# EAGLE design SparkFun LoRaSerial - 1W (EAGLE 9.6.2)
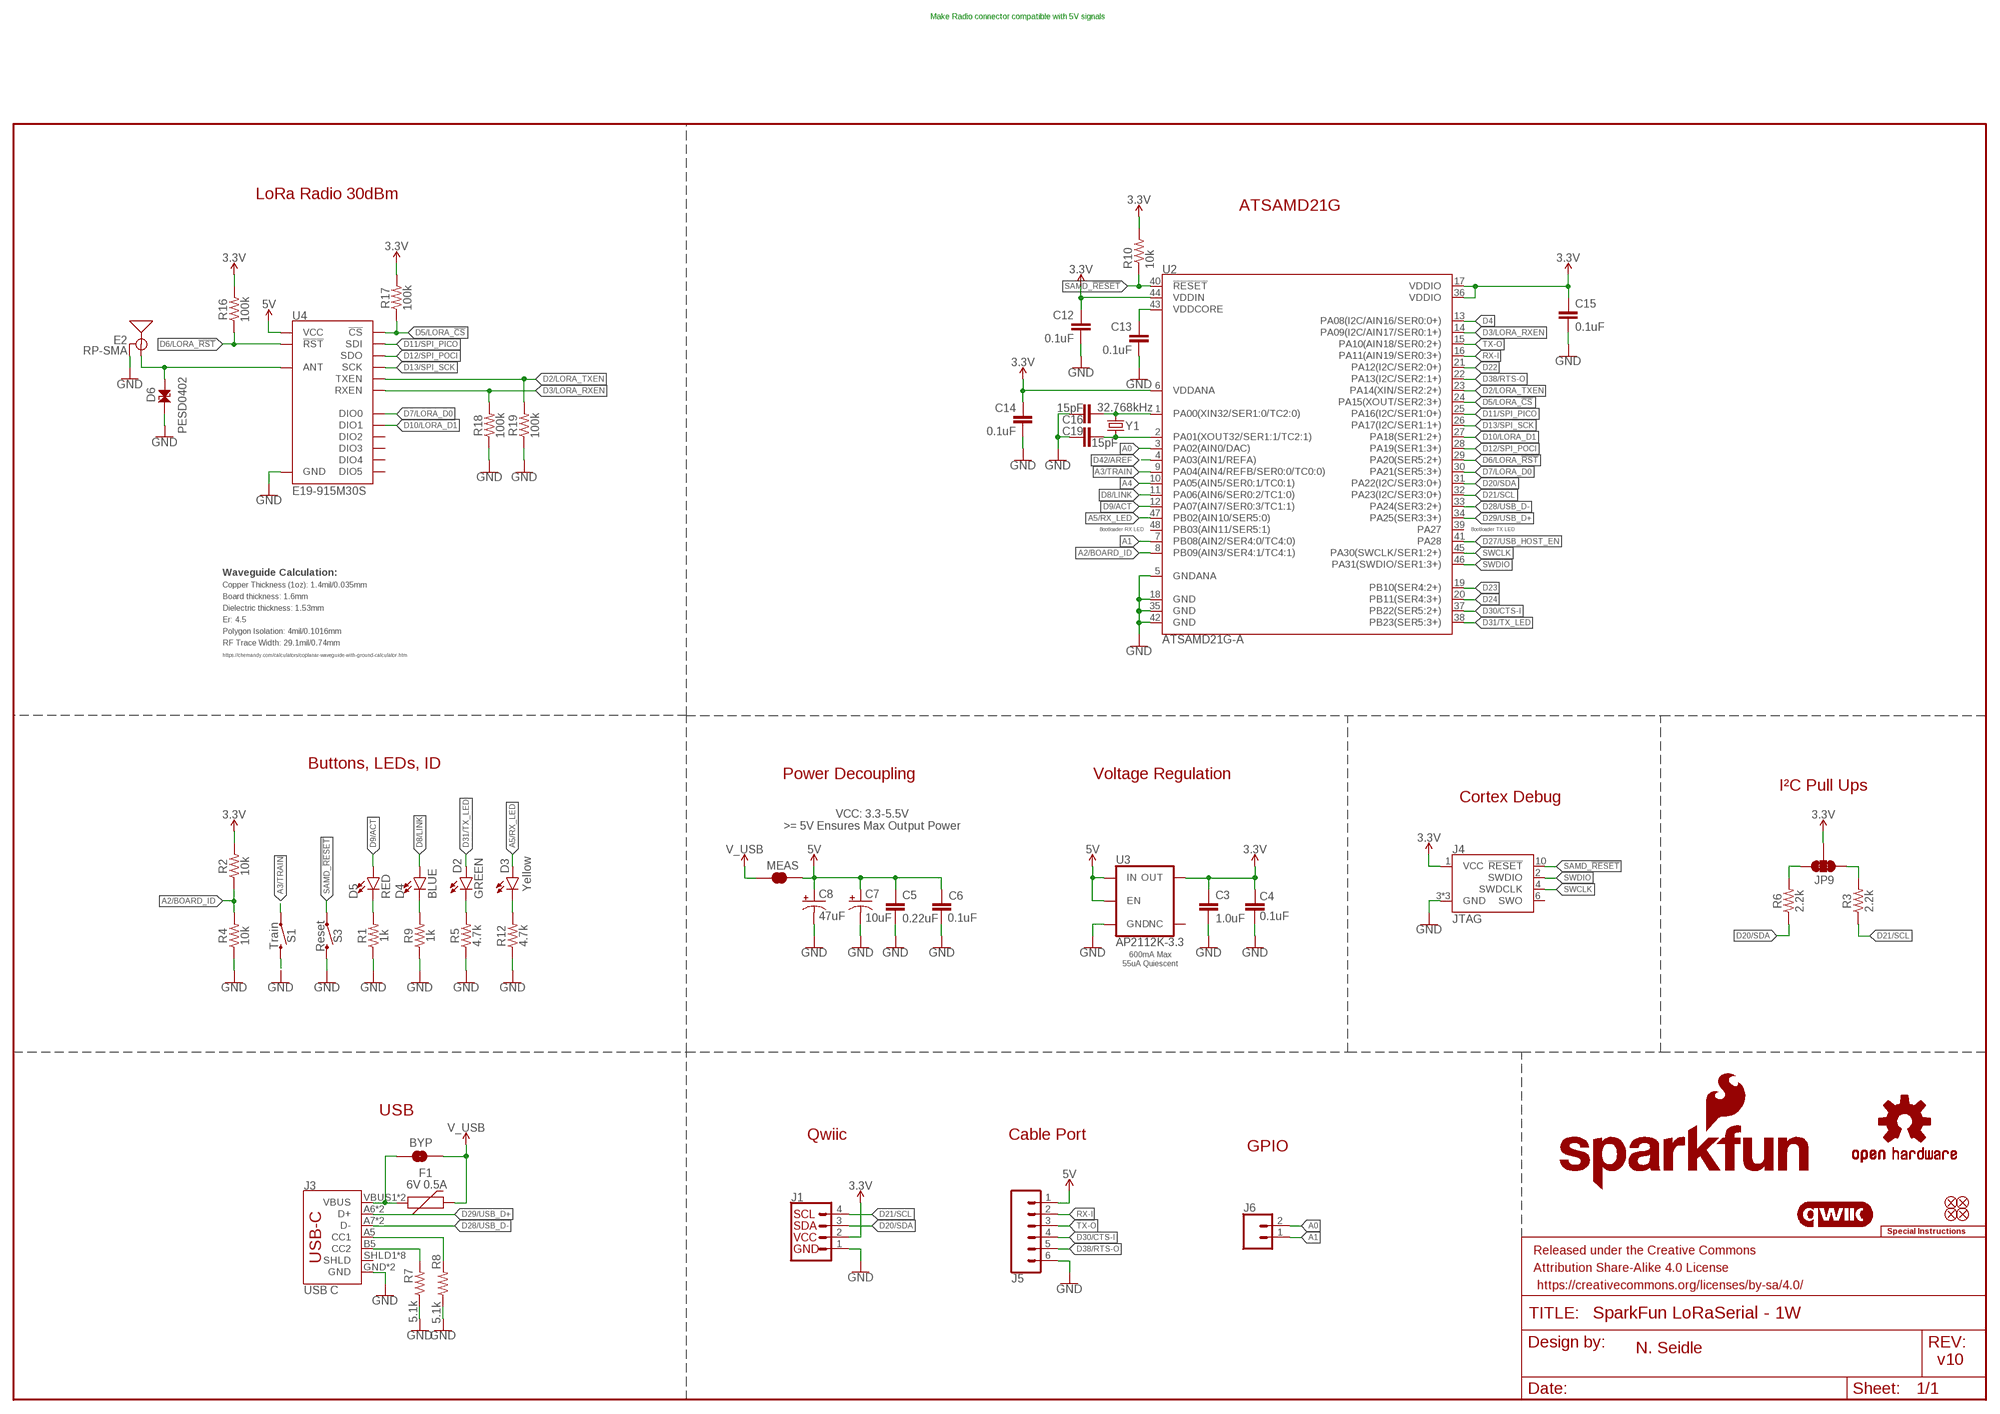
[diagram p0: schematic, sheet 1]

## Parts
BYP  JUMPER-SMT_2_NO_SILK  [SMT-JUMPER_2_NO_SILK]
C3  1.0uF  1.0UF-0603-16V-10%-X7R  [0603]
C4  0.1uF  0.1UF-0603-25V-5%  [0603]
C5  0.22uF  0.22UF-0603-25V-10%  [0603]
C6  0.1uF  0.1UF-0603-25V-(+80/-20%)  [0603]
C7  10uF  10UF-POLAR-EIA3216-16V-10%(TANT)  [EIA3216]
C8  47uF  47UF-POLAR-EIA3528-10V-10%  [EIA3528]
C12  0.1uF  0.1UF-0603-25V-(+80/-20%)  [0603]
C13  0.1uF  0.1UF-0603-25V-(+80/-20%)  [0603]
C14  0.1uF  0.1UF-0603-25V-(+80/-20%)  [0603]
C15  0.1uF  0.1UF-0603-25V-(+80/-20%)  [0603]
C16  15pF  15PF-0603-50V-5%  [0603]
C19  15pF  15PF-0603-50V-5%  [0603]
D2  GREEN  LED-GREEN0603  [LED-0603]
D3  Yellow  LED-YELLOW0603  [LED-0603]
D4  BLUE  LED-BLUE0603  [LED-0603]
D5  RED  LED-RED0603  [LED-0603]
D6  PESD0402  PESD0402-0402T  [0402-TIGHT]
E2  RP-SMA  ANTENNA-SMA-GROUNDEDEDGE_RPSMA  [RP-SMA-EDGE]
F1  6V 0.5A  PPTC_6V500MA  [0805]
FID1  FIDUCIAL1X2  [FIDUCIAL-1X2]
FID2  FIDUCIAL1X2  [FIDUCIAL-1X2]
FID3  FIDUCIAL1X2  [FIDUCIAL-1X2]
FID4  FIDUCIAL1X2  [FIDUCIAL-1X2]
FRAME3  FRAME-LEDGER  [CREATIVE_COMMONS]
J1  QWIIC_RIGHT_ANGLE  QWIIC_CONNECTORJS-1MM  [JST04_1MM_RA]
J3  USB C  USB_C16PIN  [USB-C-16P]
J4  JTAG  CORTEX_JTAG_DEBUG_MINIMUM_PTH_NS  [2X5-PTH-1.27MM-NO_SILK]
J5  CONN_06JST-SMD-LOCKING  [JST-6-SMD-1.25MM-LOCKING]
J6  CONN_021X02_NO_SILK  [1X02_NO_SILK]
JP9  JUMPER-SMT_3_2-NC_TRACE_SILK  [SMT-JUMPER_3_2-NC_TRACE_SILK]
LOGO1  SPECIAL_INSTRUCTIONS-ORDERING  [ORDERING_INSTRUCTIONS]
LOGO2  SFE_LOGO_NAME_FLAME.1_INCH  [SFE_LOGO_NAME_FLAME_.1]
LOGO3  QWIIC_LOGO_CONNECTOR  [QWIIC_5.5MM]
LOGO4  OSHW-LOGOMINI  [OSHW-LOGO-MINI]
LOGO5  SFE_LOGO_NAME_FLAME10_MM  [SFE_LOGO_NAME_FLAME_10MM]
MEAS  JUMPER-COMBO_2_NC_TRACE  [COMBO-JUMPER_2_NC_TRACE]
R1  1k  1KOHM-0603-1/10W-1%  [0603]
R2  10k  10KOHM-0603-1/10W-1%  [0603]
R3  2.2k  2.2KOHM-0603-1/10W-1%  [0603]
R4  10k  10KOHM-0603-1/10W-1%  [0603]
R5  4.7k  4.7KOHM-0603-1/10W-1%  [0603]
R6  2.2k  2.2KOHM-0603-1/10W-1%  [0603]
R7  5.1k  5.1KOHM5.1KOHM-0603-1/10W-1%  [0603]
R8  5.1k  5.1KOHM5.1KOHM-0603-1/10W-1%  [0603]
R9  1k  1KOHM-0603-1/10W-1%  [0603]
R10  10k  10KOHM-0603-1/10W-1%  [0603]
R12  4.7k  4.7KOHM-0603-1/10W-1%  [0603]
R16  100k  100KOHM-0603-1/10W-1%  [0603]
R17  100k  100KOHM-0603-1/10W-1%  [0603]
R18  100k  100KOHM-0603-1/10W-1%  [0603]
R19  100k  100KOHM-0603-1/10W-1%  [0603]
S1  Train  MOMENTARY-SWITCH-SPST-SMD-RIGHT-ANGLE  [TACTILE_SWITCH_SMD_RIGHT_ANGLE]
S3  Reset  MOMENTARY-SWITCH-SPST-SMD-5.2-TALL-REDUNDANT  [TACTILE_SWITCH_SMD_5.2MM]
U2  ATSAMD21G-A  [TQFP-48]
U3  AP2112K-3.3  V_REG_AP2112K-3.3V  [SOT23-5]
U4  E19-915M30S  E19-915MS1W  [E19-915MS1W]
Y1  32.768kHz  CRYSTAL3.2X1.5MM  [CRYSTAL-SMD-3.2X1.5MM]

## Nets
3.3V [3.3V]: C3.1 C4.2 C12.1 C14.1 C15.1 J1.2 J4.1(VCC) JP9.2 R2.2 R10.2 R16.2 R17.2 U2.6(VDDANA) U2.17(VDDIO) U2.36(VDDIO) U2.44(VDDIN) U3.5(OUT)
5V: C5.1 C6.1 C7.+ C8.A(+) J5.1 MEAS.2 MEAS.4 U3.1(IN) U3.3(EN) U4.11(VCC)
A0: J6.2 U2.3(PA02(AIN0/DAC))
A1: J6.1 U2.7(PB08(AIN2/SER4:0/TC4:0))
A2/BOARD_ID: R2.1 R4.2 U2.8(PB09(AIN3/SER4:1/TC4:1))
A3/TRAIN: S1.1 U2.9(PA04(AIN4/REFB/SER0:0/TC0:0))
A4: U2.10(PA05(AIN5/SER0:1/TC0:1))
A5/RX_LED: D3.A U2.47(PB02(AIN10/SER5:0))
CC1: J3.A5(CC1) R8.2
CC2: J3.B5(CC2) R7.2
D2/LORA_TXEN: R19.2 U2.23(PA14(XIN/SER2:2+)) U4.16(TXEN)
D3/LORA_RXEN: R18.2 U2.14(PA09(I2C/AIN17/SER0:1+)) U4.17(RXEN)
D4: U2.13(PA08(I2C/AIN16/SER0:0+))
D5/LORA_!CS!: R17.1 U2.24(PA15(XOUT/SER2:3+)) U4.15(!CS)
D6/LORA_!RST!: R16.1 U2.29(PA20(SER5:2+)) U4.8(!RST)
D7/LORA_D0: U2.30(PA21(SER5:3+)) U4.7(DIO0)
D8/LINK: D4.A U2.11(PA06(AIN6/SER0:2/TC1:0))
D9/ACT: D5.A U2.12(PA07(AIN7/SER0:3/TC1:1))
D10/LORA_D1: U2.27(PA18(SER1:2+)) U4.6(DIO1)
D11/SPI_PICO: U2.25(PA16(I2C/SER1:0+)) U4.14(SDI)
D12/SPI_POCI: U2.28(PA19(SER1:3+)) U4.13(SDO)
D13/SPI_SCK: U2.26(PA17(I2C/SER1:1+)) U4.12(SCK)
D20/SDA: J1.3 R6.1 U2.31(PA22(I2C/SER3:0+))
D21/SCL: J1.4 R3.1 U2.32(PA23(I2C/SER3:0+))
D22: U2.21(PA12(I2C/SER2:0+))
D23: U2.19(PB10(SER4:2+))
D24: U2.20(PB11(SER4:3+))
D27/USB_HOST_EN: U2.41(PA28)
D28/USB_D-: J3.A7(D-) J3.B7(D-) U2.33(PA24(SER3:2+))
D29/USB_D+: J3.A6(D+) J3.B6(D+) U2.34(PA25(SER3:3+))
D30/CTS-I: J5.4 U2.37(PB22(SER5:2+))
D31/TX_LED: D2.A U2.38(PB23(SER5:3+))
D38/RTS-O: J5.5 U2.22(PA13(I2C/SER2:1+))
D42/AREF: U2.4(PA03(AIN1/REFA))
GND: C3.2 C4.1 C5.2 C6.2 C7.- C8.C(-) C12.2 C13.2 C14.2 C15.2 C16.1 C19.2 D6.1 E2.GND@0(GND) E2.GND@1(GND) E2.GND@2(GND) E2.GND@3(GND) J1.1 J3.GND J3.GND2(GND) J4.3(GND) J4.5(GND) J4.9(GND) J5.6 R1.1 R4.1 R5.1 R7.1 R8.1 R9.1 R12.1 R18.1 R19.1 S1.2 S3.3 S3.4 U2.5(GNDANA) U2.18(GND) U2.35(GND) U2.42(GND) U3.2(GND) U4.1(GND) U4.9(GND) U4.10(GND) U4.18(GND) U4.20(GND) U4.21(GND) U4.22(GND)
LORA_ANT: D6.2 E2.SIG(SIGNAL) U4.19(ANT)
N$1: C19.1 U2.2(PA01(XOUT32/SER1:1/TC2:1)) Y1.P$1
N$2: C16.2 U2.1(PA00(XIN32/SER1:0/TC2:0)) Y1.P$2
N$3: D3.C R12.2
N$4: D2.C R5.2
N$7: D5.C R1.2
N$8: D4.C R9.2
RX-I: J5.2 U2.16(PA11(AIN19/SER0:3+))
SAMD_!RESET!: J4.10(!RESET) R10.1 S3.1 S3.2 U2.40(!RESET!)
SCL_PU1: JP9.1 R3.2
SDA_PU1: JP9.3 R6.2
SWCLK: J4.4(SWDCLK) U2.45(PA30(SWCLK/SER1:2+))
SWDIO: J4.2(SWDIO) U2.46(PA31(SWDIO/SER1:3+))
TX-O: J5.3 U2.15(PA10(AIN18/SER0:2+))
V_USB: BYP.2 F1.2 MEAS.1 MEAS.3
VDDCORE: C13.1 U2.43(VDDCORE)
VUSB [3.3V]: BYP.1 F1.1 J3.VBUS1(VBUS) J3.VBUS2(VBUS)
Unconnected: J3.SHLD1(SHLD) J3.SHLD2(SHLD) J3.SHLD3(SHLD) J3.SHLD4(SHLD) J3.SHLD5(SHLD) J3.SHLD6(SHLD) J3.SHLD7(SHLD) J3.SHLD8(SHLD) J4.6(SWO) U2.39(PA27) U2.48(PB03(AIN11/SER5:1)) U3.4(NC) U4.2(DIO5) U4.3(DIO4) U4.4(DIO3) U4.5(DIO2)

## Notes on the sheet
- Make Radio connector compatible with 5V signals
- LoRa Radio 30dBm
- ATSAMD21G
- Bootloader RX LED | Bootloader TX LED
- Waveguide Calculation:
- Copper Thickness (1oz): 1.4mil/0.035mm
- Board thickness: 1.6mm
- Dielectric thickness: 1.53mm
- Er: 4.5
- Polygon Isolation: 4mil/0.1016mm
- RF Trace Width: 29.1mil/0.74mm
- https://chemandy.com/calculators/coplanar-waveguide-with-ground-calculator.htm
- Buttons, LEDs, ID
- Power Decoupling | Voltage Regulation
- I²C Pull Ups
- Cortex Debug
- VCC: 3.3-5.5V
  >= 5V Ensures Max Output Power
- 600mA Max
  55uA Quiescent
- USB
- Qwiic | Cable Port
- GPIO
- N. Seidle
- v10

## Library data of the parts
BYP = SparkFun-Jumpers:JUMPER-SMT_2_NO: Normally open jumper This jumper has two pads in close proximity to each other. Apply solder to close the connection. Round pads are easier to solder for beginners, but are a lot larger. SparkFun Product that uses the round pads: SparkFun EL Sequencer <https://www.sparkfun.com/products/12781>
C3 = SparkFun-Capacitors:1.0UF: 1µF ceramic capacitors A capacitor is a passive two-terminal electrical component used to store electrical energy temporarily in an electric field.; PROD_ID: CAP-13930
C4 = SparkFun-Capacitors:0.1UF: 0.1µF ceramic capacitors A capacitor is a passive two-terminal electrical component used to store electrical energy temporarily in an electric field.; PROD_ID: CAP-08604
C5 = SparkFun-Capacitors:0.22UF: 0.22µF ceramic capacitors A capacitor is a passive two-terminal electrical component used to store electrical energy temporarily in an electric field.; PROD_ID: CAP-07822
C6 C12-C15 = SparkFun-Capacitors:0.1UF: 0.1µF ceramic capacitors A capacitor is a passive two-terminal electrical component used to store electrical energy temporarily in an electric field.; PROD_ID: CAP-00810
C7 = SparkFun-Capacitors:10UF-POLAR: 10.0µF polarized capacitors A capacitor is a passive two-terminal electrical component used to store electrical energy temporarily in an electric field.; PROD_ID: CAP-00811
C8 = SparkFun-Capacitors:47UF-POLAR: 47µF polarized capacitors A capacitor is a passive two-terminal electrical component used to store electrical energy temporarily in an electric field.; PROD_ID: CAP-08310
C16 C19 = SparkFun-Capacitors:15PF: 15pF ceramic capacitors A capacitor is a passive two-terminal electrical component used to store electrical energy temporarily in an electric field.; PROD_ID: CAP-07881
D2 = SparkFun-LED:LED-GREEN: Green SMD LED Used in manufacturing of various products at SparkFun Packages: 0603 - SMD 0603 package [Product Link] <http://www.futureelectronics.com/en/technologies/semiconductors/optoelectronics/leds/Pages/9894312-LTST-C190GKT.aspx?CrossPart=HSMG-C190&IM=0> LilyPad 1206 - SMD1206 LilyPad package [Product Link] <http://www.futureelectronics.com/en/Technologies/Product.aspx?ProductID=IN150NGHARVATEKCORPORATION2049943&IM=0> 1206 - SMD1206 package [Product Link] <http://www.futureelectronics.com/en/technologies/semiconductors/optoelectronics/leds/Pages/8315665-LTST-C150KGKT.aspx?IM=0> 1206 Bottom Mount -SMD 1206 Bottom Mount [Product Link] <http://www.digikey.com/product-detail/en/lite-on-inc/LTST-C230KGKT/160-1456-1-ND/386854> SparkFun Products: Pro Mini 328 -5V <https://www.sparkfun.com/products/821> RedBoard <https://www.sparkfun.com/products/12757> MP3 Trigger <https://www.sparkfun.com/products/13720> Makey Makey <https://www.sparkfun.com/products/11076>; PROD_ID: DIO-00821
D3 = SparkFun-LED:LED-YELLOW: Yellow SMD LED Used in manufacturing several products at SparkFun. Packages: 0603 - SMD 0603 package[Product Link] <http://www.kingbrightusa.com/product.asp?catalog_name=LED&product_id=APT1608SYCK> 0603 -SMART - SMART SMD 0603 package (more efficient/more expensive) [Product Link] <http://www.osram-os.com/osram_os/en/products/product-catalog/led-light-emitting-diodes/smartled-0603/ly-l29k/index.jsp> LilyPad - SMD1206 package[Product Datasheet] <https://www.sparkfun.com/datasheets/DevTools/LilyPad/Q150YUS4.pdf> SparkFun Products: Blynk Board <https://www.sparkfun.com/products/13794> IOIO-OTG <https://www.sparkfun.com/products/13613> XBee Explorer Serial <https://www.sparkfun.com/products/13225>; PROD_ID: DIO-09003
D4 = SparkFun-LED:LED-BLUE: Blue SMD LED Used in manufacturing of various products at SparkFun Packages: 0603 - SMD 0603 package [Product Link] <http://www.digikey.com/product-detail/en/SMLE12BC7TT86/511-1589-2-ND/1641808> 1206 - SMD1206 package [Product Link] <http://www.digikey.com/product-detail/en/lite-on-inc/LTST-C150TBKT/160-1643-1-ND/573584> SparkFun Products: ESP8266 Thing-Dev Board <https://www.sparkfun.com/products/13711> RedBoard <https://www.sparkfun.com/products/12757>; PROD_ID: DIO-08575
D5 = SparkFun-LED:LED-RED: Red SMD LED Used in manufacturing of most products at SparkFun Packages: 0603 - SMD 0603 package [Product Link] <http://docs.avagotech.com/docs/AV02-0551EN> 0603 SMART - SMD 0603 SMART package ( more efficient and expensive)[Product Link] <http://www.osram-os.com/Graphics/XPic2/00077099_0.pdf> 1206 - SMD1206 package [Product Link] <https://www.sparkfun.com/datasheets/DevTools/LilyPad/Q150OVS4.pdff> SparkFun Products: Pro Mini 328 -5V <https://www.sparkfun.com/products/821> RedBoard <https://www.sparkfun.com/products/12757> IOIO-OTG <https://www.sparkfun.com/products/13613>; PROD_ID: DIO-00819
D6 = SparkFun-DiscreteSemi:PESD0402: ESD protection diode PESD is used to protect a signal line from ESD.; PROD_ID: DIO-15359
E2 = SparkFun-RF:ANTENNA-SMA-GROUNDED: SMA Antenna Connector w/ Ground Edge-mount and SMD SMA connectors for RF Antennas. **4-LAYER BOARD WARNING!!** When designing a 4-layer board using any of the SMD variants, you will need to manually add a cutout polygon on any internal power layers to make sure that you don't end up with exposed copper around the edge of the routed hole for these connectors. Exposed power copper could then short to the connector body - and that would be bad. Why hasn't anyone added the cutout polygons directly to the connector footprint? Well, your internal layers (usually 2 and 15) may be covered with GND polygons and you might well want the copper to go all the way to the edge, especially under the connector SIGNAL pin. So adding cutouts to the footprint might make matters worse, not better...; PROD_ID: CONN-00827
F1 = SparkFun-Fuses:PPTC: Resettable Fuse PPTC Resettable Fuse. Really a sort of resistor with a polymeric positive temperature coefficient whose resistance increases dramatically with an increase in temperature. When heated by the power passing through the resistance rises causing the current to be limited, protecting the circuit. This is achieved by the transition of the polymer from a crystalline to an amorphous state where the conductive carbon separates breaking the conductive pathways found in the cool crystalline structure. When a PPTC cools back down it resumes conducting letting the circuit turn back on. SparkFun Products: SparkFun RedBoard - Programmed with Arduino <https://www.sparkfun.com/products/12757> Pro Micro - 5V/16MHz <https://www.sparkfun.com/products/12640> Arduino Pro 328 - 5V/16MHz <https://www.sparkfun.com/products/10915> MP3 Trigger <https://www.sparkfun.com/products/13720>; PROD_ID: RES-13945
FID1-FID4 = SparkFun-Aesthetics:FIDUCIAL: Fiducial Alignment Points Point-of-reference for pick-and-place machines and other optical instruments.
FRAME3 = SparkFun-Aesthetics:FRAME-LEDGER: Schematic Frame - Ledger Standard 11x14 US Ledger frame
J1 = SparkFun-Connectors:QWIIC_CONNECTOR: SparkFun I2C Standard Qwiic Connector An SMD 1mm pitch JST connector makes it easy and quick (get it? Qwiic?) to connect I2C devices to each other. The Qwiic system <http://www.sparkfun.com/qwiic> enables fast and solderless connection between popular platforms and various sensors and actuators. We carry 200mm <https://www.sparkfun.com/products/14204>, 100mm <https://www.sparkfun.com/products/14205>, 50mm <https://www.sparkfun.com/products/14206>, and breadboard friendly <https://www.sparkfun.com/products/14207> Qwiic cables. We also offer 10 pcs strips <https://www.sparkfun.com/products/14323> the SMD connectors.; PROD_ID: CONN-13694
J3 = USB-C:USB_C: USB Type C 16Pin Connector
J4 = SparkFun-Connectors:CORTEX_JTAG_DEBUG_MINIMUM: Cortex Debug Connector - 10 pin Supports JTAG debug, Serial Wire debug, and Serial Wire Viewer. PTH and SMD connector options available. General Connector Information <http://infocenter.arm.com/help/topic/com.arm.doc.faqs/attached/13634/cortex_debug_connectors.pdf> Products: PTH Connector <http://www.digikey.com/product-detail/en/cnc-tech/3220-10-0100-00/1175-1627-ND/3883661> -via Digi-Key SparkFun PSoc <https://www.sparkfun.com/products/13229> SparkFun T <https://www.sparkfun.com/products/13810>
J5 = SparkFun-Connectors:CONN_06: Multi connection point. Often used as Generic Header-pin footprint for 0.1 inch spaced/style header connections On any of the 0.1 inch spaced packages, you can populate with these: Break Away Headers - Straight <https://www.sparkfun.com/products/116> (PRT-00116) Break Away Male Headers - Right Angle <https://www.sparkfun.com/products/553> (PRT-00553) Female Headers <https://www.sparkfun.com/products/115> (PRT-00115) Break Away Headers - Machine Pin <https://www.sparkfun.com/products/117> (PRT-00117) Break Away Female Headers - Swiss Machine Pin <https://www.sparkfun.com/products/743> (PRT-00743) Arduino Stackable Header - 6 Pin <https://www.sparkfun.com/products/9280> (PRT-09280) For SCREWTERMINALS and SPRING TERMINALS visit here: Screw Terimnals on SparkFun.com <https://www.sparkfun.com/search/results?term=Screw+Terminals> (5mm/3.5mm/2.54mm spacing) This device is also useful as a general connection point to wire up your design to another part of your project. Our various solder wires solder well into these plated through hole pads. Hook-Up Wire - Assortment (Stranded, 22 AWG) <https://www.sparkfun.com/products/11375> (PRT-11375) Hook-Up Wire - Assortment (Solid Core, 22 AWG) <https://www.sparkfun.com/products/11367> (PRT-11367) View the entire wire category on our website here <https://www.sparkfun.com/categories/141>; PROD_ID: CONN-16497
J6 = SparkFun-Connectors:CONN_02: Multi connection point. Often used as Generic Header-pin footprint for 0.1 inch spaced/style header connections On any of the 0.1 inch spaced packages, you can populate with these: Break Away Headers - Straight <https://www.sparkfun.com/products/116> (PRT-00116) Break Away Male Headers - Right Angle <https://www.sparkfun.com/products/553> (PRT-00553) Female Headers <https://www.sparkfun.com/products/115> (PRT-00115) Break Away Headers - Machine Pin <https://www.sparkfun.com/products/117> (PRT-00117) Break Away Female Headers - Swiss Machine Pin <https://www.sparkfun.com/products/743> (PRT-00743) For SCREWTERMINALS and SPRING TERMINALS visit here: Screw Terimnals on SparkFun.com <https://www.sparkfun.com/search/results?term=Screw+Terminals> (5mm/3.5mm/2.54mm spacing) This device is also useful as a general connection point to wire up your design to another part of your project. Our various solder wires solder well into these plated through hole pads. Hook-Up Wire - Assortment (Stranded, 22 AWG) <https://www.sparkfun.com/products/11375> (PRT-11375) Hook-Up Wire - Assortment (Solid Core, 22 AWG) <https://www.sparkfun.com/products/11367> (PRT-11367) View the entire wire category on our website here <https://www.sparkfun.com/categories/141> Special notes: Molex polarized connector foot print use with: PRT-08233 with associated crimp pins and housings. 2.54_SCREWTERM for use with PRT-10571. 3.5mm Screw Terminal footprints for PRT-08084 5mm Screw Terminal footprints for use with PRT-08432
JP9 = SparkFun-Jumpers:JUMPER-SMT_3_2-NC_TRACE: Normally closed trace jumper (2 of 2 connections) This jumper has a trace between all three pads so they are normally closed (NC). Use a razor knife to open the connection(s). For best results follow the IPC guidelines for cutting traces: Cutout at least 0.063 mm (0.005 in). Remove all loose material to clean up the cut area. Seal the cut with an approved epoxy. Reapply solder to reclose the connection(s).
LOGO1 = SparkFun-Aesthetics:SPECIAL_INSTRUCTIONS: Special Ordering/Production Instructions Alert Symbol for special PCB ordering instructions or unique production process warnings. Ordering Instructions Production Instructions Types of information that should be added to box: Copper weight Soldermask color Silk color PCB thickness Number of layers PCB Standard: 1.6mm FR4 1 oz copper immersion silver plating red soldermask white silkscreen Types of information that should be added to box: Special wash requirements Depaneling instructions Humidification Glue curing Default text settings: 0.07 inch 9% ratio 50% line distance
LOGO2 LOGO5 = SparkFun-Aesthetics:SFE_LOGO_NAME_FLAME: SparkFun Font Logo w/ Flame This is the SparkFun full logo. The logo on the schematic will always be the same size; the package variant is the height of the flame part of the logo. Default layer for the logo on the board is tSilk.
LOGO3 = SparkFun-Aesthetics:QWIIC_LOGO: Qwiic Logos for placement on schematic and PCB. The 5.5mm silk logo is best for placing next to Qwiic connector.
LOGO4 = SparkFun-Aesthetics:OSHW-LOGO: Open-Source Hardware (OSHW) Logo This logo indicates the piece of hardware it is found on incorporates a OSHW license and/or adheres to the definition of open source hardware found here: http://freedomdefined.org/OSHW
MEAS = SparkFun-Jumpers:JUMPER-COMBO_2_NC_TRACE
R1 R9 = SparkFun-Resistors:1KOHM: 1kΩ resistor A resistor is a passive two-terminal electrical component that implements electrical resistance as a circuit element. Resistors act to reduce current flow, and, at the same time, act to lower voltage levels within circuits. - Wikipedia; PROD_ID: RES-07856
R2 R4 R10 = SparkFun-Resistors:10KOHM: 10kΩ resistor A resistor is a passive two-terminal electrical component that implements electrical resistance as a circuit element. Resistors act to reduce current flow, and, at the same time, act to lower voltage levels within circuits. - Wikipedia; PROD_ID: RES-00824
R3 R6 = SparkFun-Resistors:2.2KOHM: 2.2kΩ resistor A resistor is a passive two-terminal electrical component that implements electrical resistance as a circuit element. Resistors act to reduce current flow, and, at the same time, act to lower voltage levels within circuits. - Wikipedia; PROD_ID: RES-08272
R5 R12 = SparkFun-Resistors:4.7KOHM: 4.7kΩ resistor A resistor is a passive two-terminal electrical component that implements electrical resistance as a circuit element. Resistors act to reduce current flow, and, at the same time, act to lower voltage levels within circuits. - Wikipedia; PROD_ID: RES-07857
R7 R8 = SparkFun-Resistors:5.1KOHM; PROD_ID: RES-12083
R16-R19 = SparkFun-Resistors:100KOHM: 100kΩ resistor A resistor is a passive two-terminal electrical component that implements electrical resistance as a circuit element. Resistors act to reduce current flow, and, at the same time, act to lower voltage levels within circuits. - Wikipedia; PROD_ID: RES-07828
S1 = SparkFun-Switches:MOMENTARY-SWITCH-SPST: Momentary Switch (Pushbutton) - SPST Normally-open (NO) SPST momentary switches (buttons, pushbuttons). Variants PTH-12MM - 12mm square, through-hole Momentary Pushbutton Switch - 12mm Square <https://www.sparkfun.com/products/9190> (COM-09190) PTH-6.0MM, PTH-6.0MM-KIT - 6.0mm square, through-hole Mini Pushbutton Switch <https://www.sparkfun.com/products/97> (COM-00097) KIT package intended for soldering kit's - only one side of pads' copper is exposed. PTH-RIGHT-ANGLE-KIT - Right-angle, through-hole Right Angle Tactile Button <https://www.sparkfun.com/products/10791> - Used on SparkFun BigTime Watch Kit <https://www.sparkfun.com/products/11734> SMD-12MM - 12mm square, surface-mount Tactile Button - SMD (12mm) <https://www.sparkfun.com/products/12993> (COM-12993) Used on SparkFun PicoBoard <https://www.sparkfun.com/products/11888> SMD-4.5MM - 4.5mm Square Trackball Switch Used on SparkFun Blackberry Trackballer Breakout <https://www.sparkfun.com/products/13169> SMD-4.6MMX2.8MM - 4.60mm x 2.80mm, surface mount Used on SparkFun Pro Micro - RP2040 <https://www.sparkfun.com/products/17717> SMD-5.2MM, SMD-5.2-REDUNDANT - 5.2mm square, surface-mount Mini Pushbutton Switch - SMD <https://www.sparkfun.com/products/8720> (COM-08720) Used on Arduino Pro Mini <https://www.sparkfun.com/products/11114> REDUNDANT package connects both switch circuits together SMD-6.0X3.5MM - 6.0 x 3.5mm, surface mount Momentary Reset Switch SMD <https://www.sparkfun.com/products/8229> (COM-08229) SMD-6.2MM-TALL - 6.2mm square, surface mount Tactile Button - SMD (6mm) <https://www.sparkfun.com/products/12992> Used on SparkFun Digital Sandbox <https://www.sparkfun.com/products/12651> SMD-RIGHT-ANGLE - Right-angle, surface mount Used on SparkFun Block for Intel® Edison - Arduino <https://www.sparkfun.com/products/13036>; PROD_ID: COMP-12265
S3 = SparkFun-Switches:MOMENTARY-SWITCH-SPST: Momentary Switch (Pushbutton) - SPST Normally-open (NO) SPST momentary switches (buttons, pushbuttons). Variants PTH-12MM - 12mm square, through-hole Momentary Pushbutton Switch - 12mm Square <https://www.sparkfun.com/products/9190> (COM-09190) PTH-6.0MM, PTH-6.0MM-KIT - 6.0mm square, through-hole Mini Pushbutton Switch <https://www.sparkfun.com/products/97> (COM-00097) KIT package intended for soldering kit's - only one side of pads' copper is exposed. PTH-RIGHT-ANGLE-KIT - Right-angle, through-hole Right Angle Tactile Button <https://www.sparkfun.com/products/10791> - Used on SparkFun BigTime Watch Kit <https://www.sparkfun.com/products/11734> SMD-12MM - 12mm square, surface-mount Tactile Button - SMD (12mm) <https://www.sparkfun.com/products/12993> (COM-12993) Used on SparkFun PicoBoard <https://www.sparkfun.com/products/11888> SMD-4.5MM - 4.5mm Square Trackball Switch Used on SparkFun Blackberry Trackballer Breakout <https://www.sparkfun.com/products/13169> SMD-4.6MMX2.8MM - 4.60mm x 2.80mm, surface mount Used on SparkFun Pro Micro - RP2040 <https://www.sparkfun.com/products/17717> SMD-5.2MM, SMD-5.2-REDUNDANT - 5.2mm square, surface-mount Mini Pushbutton Switch - SMD <https://www.sparkfun.com/products/8720> (COM-08720) Used on Arduino Pro Mini <https://www.sparkfun.com/products/11114> REDUNDANT package connects both switch circuits together SMD-6.0X3.5MM - 6.0 x 3.5mm, surface mount Momentary Reset Switch SMD <https://www.sparkfun.com/products/8229> (COM-08229) SMD-6.2MM-TALL - 6.2mm square, surface mount Tactile Button - SMD (6mm) <https://www.sparkfun.com/products/12992> Used on SparkFun Digital Sandbox <https://www.sparkfun.com/products/12651> SMD-RIGHT-ANGLE - Right-angle, surface mount Used on SparkFun Block for Intel® Edison - Arduino <https://www.sparkfun.com/products/13036>; PROD_ID: SWCH-14139
U2 = samd21-temp:ATSAMD21G: Atmel SAMD21G SMART ARM-Based Microcontroller The Atmel ® | SMART ™ SAM D21 is a series of low-power microcontrollers using the 32-bit ARM ® Cortex ® -M0+ processor, and ranging from 32- to 64-pins with up to 256KB Flash and 32KB of SRAM. The SAM D21 devices operate at a maximum frequency of 48MHz and reach 2.46 CoreMark/MHz. They are designed for simple and intuitive migration with identical peripheral modules, hex compatible code, identical linear address map and pin compatible migration paths between all devices in the product series. All devices include intelligent and flexible peripherals, Atmel Event System for inter-peripheral signaling, and support for capacitive touch button, slider and wheel user interfaces.; PROD_ID: IC-13064
U3 = SparkFun-IC-Power:V_REG_AP2112: AP2112 - 600mA CMOS LDO Regulator w/ Enable The AP2112 is CMOS process low dropout linear regulator with enable function, the regulator delivers a guaranteed 600mA (min.) continuous load current. Features Output Voltage Accuracy: ±1.5% Output Current: 600mA (Min.) Foldback Short Current Protection: 50mA Enable Function to Turn ON/OFF VOUT Low Dropout Voltage (3.3V): 250mV (Typ.) @IOUT=600mA Excellent Load Regulation: 0.2%/A (Typ.) Excellent Line Regulation: 0.02%/V (Typ.) Low Quiescent Current: 55μA (Typ.) Low Standby Current: 0.01μA (Typ.) Low Output Noise: 50μVRMS PSRR: 100Hz -65dB, 1kHz -65dB OTSD Protection Stable with 1.0μF Flexible Cap: Ceramic, Tantalum and Aluminum Electrolytic Operation Temperature Range: -40°C to 85°C ESD: MM 400V, HBM 4000V; PROD_ID: VREG-12457; VALUE: 3.3V
U4 = SparkFun-RF:E19-915MS1W: Chengdu Ebyte E19-915M30S - 915M LoRa (FSK) TRX Using SX1276 This is a 915 MHz LoRa (or optionally FSK) modulated transciver bassed on the Semtech SX1276. It has a high ouput power of 1W an a pre-installed U.FL connector. Can be used with LoRa WAN with DIO0, DIO1, and DIO2 hooked up to controller interrupt inputs SparkFun Products: SAMD21 Pro RF 1W <https://www.sparkfun.com/products/15034>; PROD_ID: IC-14076
Y1 = samd21-temp:CRYSTAL: Various standard crystals. Proven footprints.; PROD_ID: XTAL-13062

## Net classes
1 3.3V: width 0.305 mm

## Board
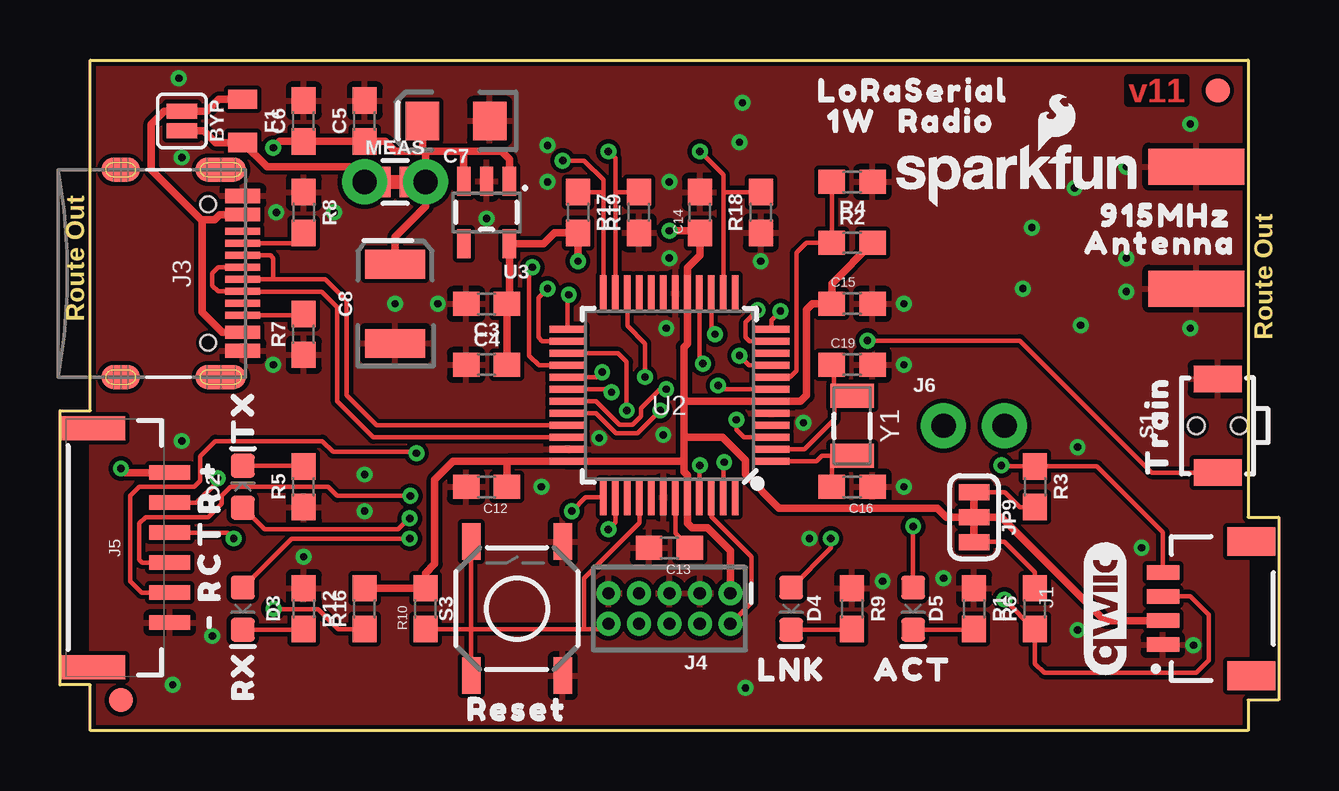
[diagram p1: board, top side]
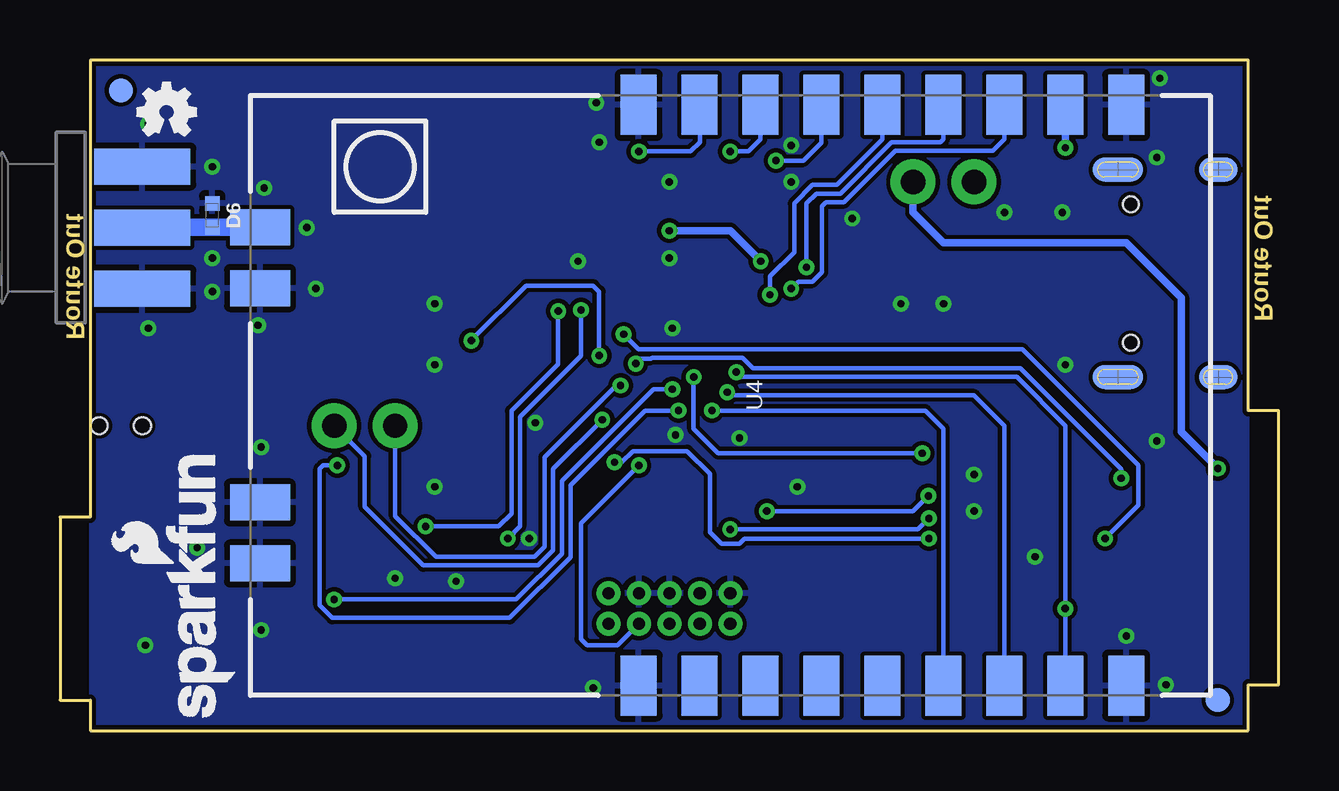
[diagram p2: board, bottom side, seen from below]

Size 50.8 x 27.94 mm. Coordinates in mm from the lower left corner, seen from the top.
Outline: 1.27,0 1.27,1.91 0,1.91 0,13.34 1.27,13.34 1.27,27.94 49.53,27.94 49.53,8.89 50.8,8.89 50.8,1.27 49.53,1.27 49.53,0 1.27,0
Copper layers (1*16): Top 0.035mm / dielectric 1.5mm / Bottom 0.035mm
Design rules "SparkFun-2-Layer-General-JLCPCB": minimum track width 7mil, minimum drill 0.3mm, track to track 7mil, track to pad 7mil, pad to pad 7mil, via to via 7mil, smd to smd 7mil, copper to edge 7mil, drill to drill 7mil, minimum pad ring 7mil, minimum via ring 7mil, stop-mask expansion 3mil, vias tented up to drill 25mil, thermal gap 10mil

### Footprints (pad centres in the part's own frame; a part is rotated, then mirrored left to right if it is on the bottom)
SMT-JUMPER_2_NO_SILK = smd 0.635 x 1.27: 1 -0.406,0; 2 0.406,0
0603 = smd 1.1 x 1: 1 -0.85,0; 2 0.85,0
EIA3216 = smd 1.4 x 1.6: + 1.4,0; - -1.4,0
EIA3528 = smd 1.2 x 2.5: A 1.65,0; C -1.65,0
LED-0603 = smd 1 x 1: A -0.877,0; C 0.877,0
0402-TIGHT = smd 0.6 x 0.6: 1 -0.5,0; 2 0.5,0
RP-SMA-EDGE = smd 1.5 x 4: GND@0 -2.54,0; GND@1 2.54,0; SIG 0,0 | smd 1.5 x 4 bottom: GND@2 -2.54,0; GND@3 2.54,0
0805 = smd 0.8 x 1.2: 1 -0.9,0; 2 0.9,0
FIDUCIAL-1X2 = smd 1 x 1: 1 0,0
JST04_1MM_RA = smd 0.6 x 1.35: 1 -1.5,0; 2 -0.5,0; 3 0.5,0; 4 1.5,0 | smd 1.2 x 2: NC1 2.8,-3.675; NC2 -2.8,-3.675
USB-C-16P = smd 0.3 x 1.45: A5 -1.25,0; A6 -0.25,0; A7 0.25,0; A8 1.25,0; B5 1.75,0; B6 0.75,0; B7 -0.75,0; B8 -1.75,0 | smd 0.6 x 1.45: GND -3.225,0; GND2 3.225,0 | smd 1 x 2.1: SHLD1 -4.32,-0.915; SHLD2 4.32,-0.915 | smd 1 x 2.1 bottom: SHLD3 -4.32,-0.915; SHLD4 4.32,-0.915 | smd 1 x 1.6: SHLD5 -4.32,-5.095; SHLD8 4.32,-5.095 | smd 1 x 1.6 bottom: SHLD6 -4.32,-5.095; SHLD7 4.32,-5.095 | smd 0.55 x 1.45: VBUS1 -2.45,0; VBUS2 2.45,0 | hole 0.65: -2.89,-1.445; 2.89,-1.445
2X5-PTH-1.27MM-NO_SILK = drill 0.508 pad 1: 1 -2.54,-0.635; 2 -2.54,0.635; 3 -1.27,-0.635; 4 -1.27,0.635; 5 0,-0.635; 6 0,0.635; 7 1.27,-0.635; 8 1.27,0.635; 9 2.54,-0.635; 10 2.54,0.635
JST-6-SMD-1.25MM-LOCKING = smd 0.6 x 1.7: 1 -3.125,3.3; 2 -1.875,3.3; 3 -0.625,3.3; 4 0.625,3.3; 5 1.875,3.3; 6 3.125,3.3 | smd 1 x 2.7: NC1 4.975,0.1; NC2 -4.975,0.1
1X02_NO_SILK = drill 1.016 pad 1.88: 1 0,0; 2 2.54,0
SMT-JUMPER_3_2-NC_TRACE_SILK = smd 0.66 x 1.27: 1 -1.041,0; 2 0,0; 3 1.041,0
COMBO-JUMPER_2_NC_TRACE = smd 0.635 x 1.27: 1 -0.508,0; 2 0.508,0 | drill 1.016 pad 1.88: 3 -1.27,0; 4 1.27,0
TACTILE_SWITCH_SMD_RIGHT_ANGLE = smd 1.1 x 2: 1 -1.95,0; 2 1.95,0 | hole 0.7: 0,0.9; 0,-0.9
TACTILE_SWITCH_SMD_5.2MM = smd 1.524 x 0.762: 1 -2.794,1.905; 2 2.794,1.905; 3 -2.794,-1.905; 4 2.794,-1.905
TQFP-48 = smd 1.5 x 0.28: 1 -4.25,2.75; 2 -4.25,2.25; 3 -4.25,1.75; 4 -4.25,1.25; 5 -4.25,0.75; 6 -4.25,0.25; 7 -4.25,-0.25; 8 -4.25,-0.75; 9 -4.25,-1.25; 10 -4.25,-1.75; 11 -4.25,-2.25; 12 -4.25,-2.75; 25 4.25,-2.75; 26 4.25,-2.25; 27 4.25,-1.75; 28 4.25,-1.25; 29 4.25,-0.75; 30 4.25,-0.25; 31 4.25,0.25; 32 4.25,0.75; 33 4.25,1.25; 34 4.25,1.75; 35 4.25,2.25; 36 4.25,2.75 | smd 0.28 x 1.5: 13 -2.75,-4.25; 14 -2.25,-4.25; 15 -1.75,-4.25; 16 -1.25,-4.25; 17 -0.75,-4.25; 18 -0.25,-4.25; 19 0.25,-4.25; 20 0.75,-4.25; 21 1.25,-4.25; 22 1.75,-4.25; 23 2.25,-4.25; 24 2.75,-4.25; 37 2.75,4.25; 38 2.25,4.25; 39 1.75,4.25; 40 1.25,4.25; 41 0.75,4.25; 42 0.25,4.25; 43 -0.25,4.25; 44 -0.75,4.25; 45 -1.25,4.25; 46 -1.75,4.25; 47 -2.25,4.25; 48 -2.75,4.25
SOT23-5 = smd 0.55 x 1.2: 1 -0.95,-1.3; 2 0,-1.3; 3 0.95,-1.3; 4 0.95,1.3; 5 -0.95,1.3
E19-915MS1W = smd 2.5 x 1.5: 1 12.1,-3.82; 2 12.1,-1.28; 3 12.1,1.26; 4 12.1,3.8; 5 12.1,6.34; 6 12.1,8.88; 7 12.1,11.42; 8 12.1,13.96; 9 12.1,16.5; 10 -12.1,16.5; 11 -12.1,13.96; 12 -12.1,11.42; 13 -12.1,8.88; 14 -12.1,6.34; 15 -12.1,3.8; 16 -12.1,1.26; 17 -12.1,-1.28; 18 -12.1,-3.82 | smd 1.5 x 2.5: 19 -7,-19.6; 20 -4.46,-19.6; 21 4.46,-19.6; 22 7,-19.6
CRYSTAL-SMD-3.2X1.5MM = smd 1 x 1.8: P$1 -1.25,0; P$2 1.25,0

### Placement (x,y rotation side)
BYP  5.08,25.4 270 top
C3  17.78,17.78 180 top
C4  17.78,15.24 0 top
C5  12.7,25.4 90 top
C6  10.16,25.4 90 top
C7  16.51,25.4 180 top
C8  13.97,17.78 90 top
C12  17.78,10.16 180 top
C13  25.4,7.62 180 top
C14  26.67,21.59 90 top
C15  33.02,17.78 0 top
C16  33.02,10.16 180 top
C19  33.02,15.24 0 top
D2  7.62,10.16 90 top
D3  7.62,5.08 270 top
D4  30.48,5.08 270 top
D5  35.56,5.08 270 top
D6  44.45,21.46 270 bottom
E2  47.37,20.95 90 bottom
F1  7.62,25.4 270 top
FID1  2.54,1.27 0 bottom
FID2  48.26,26.67 0 bottom
FID3  48.26,26.67 0 top
FID4  2.54,1.27 0 top
FRAME3  91.44,-8.89 0 top  (outside the outline)
J1  45.97,5.08 90 top
J3  7.62,19.05 270 top
J4  25.4,5.08 180 top
J5  1.27,7.62 270 top
J6  36.83,12.7 0 top
JP9  38.1,8.89 270 top
LOGO1  73.66,50.8 0 top  (outside the outline)
LOGO2  44.96,6.1 90 bottom
LOGO3  43.56,5.08 90 top
LOGO4  46.35,25.78 0 bottom
LOGO5  39.88,23.24 0 top
MEAS  13.97,22.86 0 top
R1  38.1,5.08 270 top
R2  33.02,20.32 0 top
R3  40.64,10.16 270 top
R4  33.02,22.86 180 top
R5  10.16,10.16 90 top
R6  40.64,5.08 90 top
R7  10.16,16.51 90 top
R8  10.16,21.59 270 top
R9  33.02,5.08 270 top
R10  15.24,5.08 90 top
R12  10.16,5.08 270 top
R16  12.7,5.08 90 top
R17  21.59,21.59 270 top
R18  29.21,21.59 90 top
R19  24.13,21.59 90 top
S1  48.26,12.7 90 top
S3  19.05,5.08 90 top
U2  25.4,13.97 180 top
U3  17.78,21.59 180 top
U4  22.86,13.97 270 bottom
U$1  [1W1]  33.02,25.4 0 top
U$2  [RESET0]  19.05,0.89 0 top
U$3  [915MHZ0]  46.1,21.46 0 top
U$4  [TRAIN0]  45.72,12.7 90 top
U$5  [RADIO2]  36.96,25.4 0 top
U$6  [ACT3]  35.56,2.54 0 top
U$7  [LNK2]  30.48,2.54 0 top
U$9  [ANTENNA1]  45.85,20.32 0 top
U$10  [RX1]  7.62,2.29 90 top
U$11  [TX0]  7.62,13.08 90 top
U$12  [#0]  6.22,10.79 0 top
U$13  [#1]  6.22,4.57 90 top
U$14  [R3]  6.22,5.84 90 top
U$15  [T2]  6.22,8.26 90 top
U$16  [C0]  6.22,6.99 90 top
U$17  [R1]  6.22,9.53 90 top
U$18  [LORASERIAL0]  35.56,26.67 0 top
Y1  33.02,12.7 270 top

### Tracks (layer width: path | path; a pad name or v marks a point on that pad's centre or on a via)
3.3V  (via drill 0.3)
  Top 0.305: 26.01,13.72 26.01,15.98 26.15,16.12 U2.17 26.15,19.29 26.67,19.81 C14.1 26.58,20.83 v25.4,20.83 | 26.01,13.72 U2.6 30.86,13.72 31.11,13.97 31.11,17.53 31.37,17.78 C15.1 32.17,18.62 R2.2 | C4.2 C3.1 18.73,17.88 U3.5 20.16,20.29 20.61,20.74 R17.2 v21.59,19.56 | R16.2 R10.2 15.24,6.57 15.62,6.95 15.62,10.46 16.38,11.22 18.67,11.22 | J4.1 27.94,7.49 26.98,8.45 26.35,8.45 26.15,8.65 U2.44 26.15,10.63 26.01,10.78 26.01,11.3 | 18.67,11.22 U2.36 25.93,11.22 26.01,11.3 | C12.1 18.63,11.18 18.67,11.22 | 26.01,11.3 26.01,12.19 | 26.01,12.19 26.01,13.72 | 26.01,12.19 26.03,12.22 27.62,12.22 28.57,11.27 28.57,10.67 29.97,9.27 36.58,9.27 36.96,8.89 JP9.2 39.24,8.89 43.55,4.58 J1.2
  Bottom 0.305: v21.59,19.56 22.86,20.83 v25.4,20.83
5V  (via drill 0.3)
  Top 0.305: v8.89,24.28 9.16,24.55 C6.1 C5.1 13.55,24.55 13.97,24.13 15.11,24.13 | U3.1 18.73,23.82 18.41,24.13 16.76,24.13 | 15.11,24.13 15.24,24.13 | 15.24,24.13 16.76,24.13 | U3.3 16.83,24.06 16.76,24.13 | C7.+ 15.11,24.13 | MEAS.4 15.24,24.13 | MEAS.2 MEAS.4 | MEAS.4 15.24,21.84 13.97,20.57 C8.A | J5.1 2.72,10.74 v2.54,10.92
  Bottom 0.305: v8.89,24.28 U4.11 | MEAS.4 15.24,21.59 13.97,20.32 6.35,20.32 4.06,18.03 4.06,12.45 v2.54,10.92
A0  (via drill 0.3)
  Top 0.178: v28.19,12.95 28.19,12.53 28.5,12.22 U2.3
  Bottom 0.178: v28.19,12.95 30.24,10.91 30.24,7.52 30.88,6.88 35.66,6.88 38.1,9.32 38.1,11.43 J6.2
A1  (via drill 0.3)
  Top 0.178: U2.7 27.59,14.22 v27.43,14.38
  Bottom 0.178: v27.43,14.38 27.61,14.38 30.59,11.4 30.59,7.67 31.03,7.23 35.13,7.23 36.83,8.94 J6.1
A2/BOARD_ID
  Top 0.178: U2.8 30.42,14.72 30.7,15 30.7,19.9 31.11,20.32 R2.1 R4.2
A3/TRAIN  (via drill 0.3)
  Top 0.178: U2.9 28.72,15.22 v28.32,15.62 | v33.66,16.25 40.01,16.25 45.51,10.75 S1.1
  Bottom 0.178: v28.32,15.62 28.32,18.29 28.57,18.54 31.37,18.54 v33.66,16.26 v33.66,16.25
A5/RX_LED  (via drill 0.3)
  Top 0.178: U2.47 27.65,11.14 v27.69,11.18 | D3.A 9.66,8 v14.58,8
  Bottom 0.178: v27.69,11.18 27.39,11.18 26.92,11.65 24.66,11.65 23.71,10.7 23.71,8.26 23.23,7.79 22.49,7.79 22.27,8 v14.58,8
CC1
  Top 0.178: J3.A5 9.72,20.3 R8.2
CC2
  Top 0.178: J3.B5 10.1,17.3 R7.2
D2/LORA_TXEN  (via drill 0.3)
  Top 0.178: U2.23 23.15,22.48 | 23.15,22.48 23.15,23.84 v22.86,24.13 | R19.2 23.19,22.44 23.15,22.48
  Bottom 0.178: v22.86,24.13 22.1,24.13 21.6,24.63 U4.16
D3/LORA_RXEN  (via drill 0.3)
  Top 0.178: U2.14 27.65,22.48 | 27.65,22.48 27.65,23.15 v26.67,24.13 | R18.2 27.69,22.44 27.65,22.48
  Bottom 0.178: v26.67,24.13 24.51,24.13 24.13,24.51 U4.17
D5/LORA_!CS!  (via drill 0.3)
  Top 0.178: U2.24 22.65,22.48 | 22.65,22.48 22.65,22.94 21.84,23.75 v20.95,23.75 | R17.1 22.61,22.44 22.65,22.48
  Bottom 0.178: v20.95,23.75 19.81,23.75 19.06,24.5 U4.15
D6/LORA_!RST!  (via drill 0.3)
  Top 0.178: U2.29 22.39,14.72 v22.61,14.94 | R16.1 11.59,4.23 10.77,5.05 8.93,5.05 v8.9,5.08
  Bottom 0.178: U4.8 v8.9,5.08 8.9,12.71 10.92,14.73 22.61,14.73 v22.61,14.94
D7/LORA_D0  (via drill 0.3)
  Top 0.178: U2.30 22.86,14.22 v22.99,14.1
  Bottom 0.178: U4.7 11.44,12.71 12.7,13.97 22.86,13.97 v22.99,14.1
D8/LINK  (via drill 0.3)
  Top 0.178: v32.13,8 32.13,7.61 D4.A | U2.11 28.74,16.22 28.57,16.38 28.57,17.02 v29.08,17.53
  Bottom 0.178: v32.13,8 31.62,8.51 31.62,13.08 29.08,15.62 v29.08,17.53
D9/ACT  (via drill 0.3)
  Top 0.178: U2.12 29.65,17.1 v30.03,17.48 | v35.56,8.51 D5.A
  Bottom 0.178: v35.56,8.51 32.51,8.51 31.98,9.04 31.98,13.32 30.03,15.27 v30.03,17.48
D10/LORA_D1  (via drill 0.3)
  Top 0.178: v23.62,13.34 23.62,15.37 23.27,15.72 U2.27
  Bottom 0.178: U4.6 13.98,12.58 14.73,13.34 v23.62,13.34
D11/SPI_PICO  (via drill 0.3)
  Top 0.178: U2.25 21.15,18.1 v21.21,18.16
  Bottom 0.178: U4.14 16.52,24.63 18.41,22.73 19.43,22.73 20.19,21.97 20.19,19.94 21.21,18.92 v21.21,18.16
D12/SPI_POCI  (via drill 0.3)
  Top 0.178: U2.28 19.96,15.22 19.56,15.62 19.56,19.18 v19.68,19.3
  Bottom 0.178: v19.68,19.3 19.68,21.97 19.28,22.38 18.27,22.38 16.13,24.51 14.1,24.51 13.97,24.64 U4.13
D13/SPI_SCK  (via drill 0.3)
  Top 0.178: U2.26 20.1,16.22 19.94,16.38 19.94,18.03 v20.32,18.41
  Bottom 0.178: v20.32,18.41 20.03,18.71 19.44,18.71 19.05,19.09 19.05,21.84 18.87,22.02 18.12,22.02 15.99,24.16 11.91,24.16 11.44,24.63 U4.12
D20/SDA  (via drill 0.3)
  Top 0.178: U2.31 22.35,13.72 23.33,12.74 23.87,12.74 24.22,13.09 24.22,13.42 25.02,14.22 v25.27,14.22 | v39.37,5.46 40.6,4.23 R6.1 40.64,2.79 41.02,2.41 47.37,2.41 47.88,2.92 47.88,4.83 47.12,5.59 45.98,5.59 J1.3
  Bottom 0.178: v25.27,14.22 26.06,14.22 29.88,10.4 29.88,7.37 31.8,5.46 v39.37,5.46
D21/SCL  (via drill 0.3)
  Top 0.178: J1.4 45.97,8.26 43.22,11.01 R3.1 39.28,11.01 v39.24,11.05 | U2.32 22.34,13.22 23.18,12.38 24.07,12.38 v25.02,13.34
  Bottom 0.178: v25.02,13.34 26.42,13.34 29.53,10.22 29.53,7.22 32.05,4.7 39.45,4.7 39.97,5.21 39.97,10.91 39.83,11.05 v39.24,11.05
D28/USB_D-
  Top 0.178: J3.A7 8.89,18.8 | 8.89,18.8 11.04,18.8 11.94,17.91 11.94,13.97 13.19,12.72 U2.33 | J3.B7 8.78,19.8 8.89,19.68 8.89,18.8
D29/USB_D+
  Top 0.178: U2.34 13.05,12.22 11.56,13.72 11.56,17.64 10.91,18.29 7.63,18.29 J3.B6 6.59,18.3 6.35,18.54 6.35,19.05 6.6,19.3 J3.A6
D30/CTS-I  (via drill 0.3)
  Top 0.178: U2.37 21.91,9.72 v21.34,9.14 | v14.61,9.78 11.56,9.78 11.18,10.16 7.11,10.16 6.73,9.78 6.73,9.45 6.18,8.9 3.56,8.9 3.3,8.64 3.3,7.11 3.42,7 J5.4
  Bottom 0.178: v21.34,9.14 15.24,9.14 v14.61,9.78
D31/TX_LED  (via drill 0.3)
  Top 0.178: v14.58,8.84 14.55,8.84 14.1,8.38 8.52,8.38 D2.A | U2.38 23.15,8.67 v22.86,8.38
  Bottom 0.178: v22.86,8.38 15.04,8.38 14.83,8.6 14.82,8.6 v14.58,8.84
D38/RTS-O  (via drill 0.3)
  Top 0.178: v14.86,11.56 14.81,11.61 11.38,11.61 10.93,12.06 6.48,12.06 5.84,11.43 5.84,10.41 5.59,10.16 3.3,10.16 2.92,9.78 2.92,6.22 3.4,5.75 J5.5 | v24.38,14.73 24.38,16.12 23.65,16.86 U2.22
  Bottom 0.178: v14.86,11.56 23.37,11.56 24.38,12.57 v24.38,14.73
GND  (via drill 0.3)
  other vias: 13.97,17.78 15.75,17.78 17.78,21.34 11.43,21.59 8.89,15.24 9.02,21.59 20.32,24.38 20.32,22.86 25.4,22.86 29.21,19.56 25.4,19.68 25.27,16.76 25.15,12.32 30.99,12.83 35.18,15.24 35.18,17.78 35.18,10.16 12.7,9.14 20.07,10.16 5.08,12.06 6.35,3.94 4.7,1.91 34.29,6.22 36.83,6.35 28.57,1.78 45.09,7.62 42.42,11.81 42.42,4.19 47.12,16.76 44.45,18.29 42.55,16.89 40.13,18.41 44.45,19.68 44.45,23.5 47.12,25.27 42.29,22.61 40.51,20.95 28.45,26.16 28.32,24.51 4.95,27.18 5.08,23.88 10.16,7.24 47.24,3.56 12.7,10.67 22.48,12.19 31.24,8
  pour Top (isolate 0.102): 1.27,0 1.27,27.94 49.53,27.94 49.53,0
  pour Bottom (isolate 0.102): 1.27,0 1.27,27.94 49.53,27.94 49.53,0
LORA_ANT
  Bottom 0.739: U4.19 D6.2 47.36,20.96 E2.SIG
N$1
  Top 0.178: U2.2 31.02,11.72 32.28,12.97 32.28,13.95 | C19.1 32.26,15.15 32.26,13.97 32.28,13.95 | 32.28,13.95 Y1.P$1
N$2
  Top 0.178: U2.1 31.54,11.22 31.77,11.45 32.13,11.45 | 32.13,11.45 Y1.P$2 | C16.2 32.17,11.41 32.13,11.45
N$3
  Top 0.178: D3.C 10.13,4.2 R12.2
N$4
  Top 0.178: D2.C 10.13,11.04 R5.2
N$7
  Top 0.178: D5.C 38.07,4.2 R1.2
N$8
  Top 0.178: D4.C 32.99,4.2 R9.2
RX-I  (via drill 0.3)
  Top 0.178: U2.16 26.65,15.44 v26.8,15.29 | J5.2 5.68,9.49 6.57,10.38 v6.57,10.51
  Bottom 0.178: v26.8,15.29 26.59,15.49 26.16,15.49 26.12,15.53 22.36,15.53 21.91,15.09 10.78,15.09 6.57,10.88 v6.57,10.51
SAMD_!RESET!
  Top 0.178: U2.40 24.15,8.66 21.84,6.35 21.84,4.23 | S3.1 17.14,4.19 | 17.14,4.19 S3.2 | R10.1 17.11,4.23 | 17.11,4.23 17.14,4.19 | J4.10 22.64,4.23 21.84,4.23 | 21.84,4.23 17.11,4.23
SCL_PU1
  Top 0.178: R3.2 40.01,9.31 39.38,9.93 JP9.1
SDA_PU1
  Top 0.178: R6.2 40.64,6.6 39.37,7.87 38.12,7.87 JP9.3
SWCLK  (via drill 0.3)
  Top 0.178: U2.45 26.65,11.03 v26.67,11.05
  Bottom 0.178: v26.67,11.05 29.08,8.64 29.08,3.81 28.83,3.56 27.56,3.56 J4.4
SWDIO
  Top 0.178: U2.46 27.15,8.92 28.83,7.24 28.83,5.33 J4.2
TX-O  (via drill 0.3)
  Top 0.178: v27.3,16.51 27.15,16.66 U2.15 | J5.3 7,8.24 v7.24,8
  Bottom 0.178: v7.24,8 5.84,9.4 5.84,11.05 10.68,15.89 26.68,15.89 v27.3,16.51
V_USB
  Top 0.305: BYP.2 5.99,24.99 6.49,24.5 F1.2 8.62,23.5 12.06,23.5 MEAS.3 MEAS.1
VDDCORE
  Top 0.178: U2.43 25.65,8.22 C13.1
VUSB
  Top 0.305: J3.VBUS1 6.66,21.5 6.45,21.29 5.89,21.29 | 5.89,21.29 3.81,23.37 3.81,25.27 4.34,25.81 BYP.1 6.12,25.81 6.62,26.3 F1.1 | J3.VBUS2 6.77,16.6 5.93,17.44 5.93,21.25 5.89,21.29

### Text on the board
Top: v11
Milling: Route Out | Route Out
Measures: Dimensions in mm
tDocu: 2-Layer PCB / 1.6mm Thickness / 1oz Copper / HASL RoHS Finish | N. Seidle